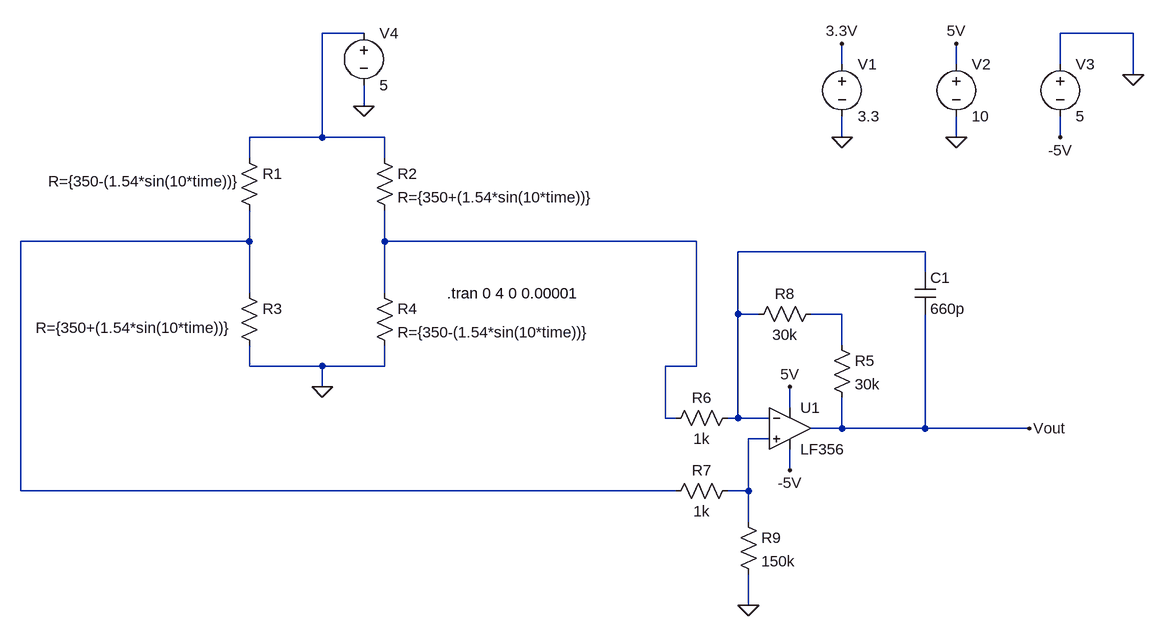
[diagram p0: schematic WheatstoneAndAmplifier - C.asc]
WheatstoneAndAmplifier - C.asc, the LTspice schematic file:
Version 4
SHEET 1 880 1060
WIRE -656 32 -720 32
WIRE 528 32 416 32
WIRE 80 80 80 48
WIRE 256 80 256 48
WIRE 416 80 416 32
WIRE 528 96 528 32
WIRE -656 144 -656 112
WIRE -720 192 -720 32
WIRE -720 192 -832 192
WIRE -624 192 -720 192
WIRE 80 192 80 160
WIRE 256 192 256 160
WIRE 416 192 416 160
WIRE -832 224 -832 192
WIRE -624 224 -624 192
WIRE -832 352 -832 304
WIRE -832 352 -1184 352
WIRE -624 352 -624 304
WIRE -144 352 -624 352
WIRE 208 368 -80 368
WIRE 208 400 208 368
WIRE -832 432 -832 352
WIRE -624 432 -624 352
WIRE -80 464 -80 368
WIRE -48 464 -80 464
WIRE 80 464 32 464
WIRE 80 512 80 464
WIRE -832 544 -832 512
WIRE -720 544 -832 544
WIRE -624 544 -624 512
WIRE -624 544 -720 544
WIRE -144 544 -144 352
WIRE -144 544 -192 544
WIRE -720 576 -720 544
WIRE 0 608 0 576
WIRE -192 624 -192 544
WIRE -176 624 -192 624
WIRE -80 624 -80 464
WIRE -80 624 -96 624
WIRE -32 624 -80 624
WIRE 80 640 80 592
WIRE 80 640 32 640
WIRE 208 640 208 464
WIRE 208 640 80 640
WIRE 368 640 208 640
WIRE -32 656 -64 656
WIRE 0 704 0 672
WIRE -1184 736 -1184 352
WIRE -176 736 -1184 736
WIRE -64 736 -64 656
WIRE -64 736 -96 736
WIRE -64 784 -64 736
WIRE -64 912 -64 864
FLAG 80 192 0
FLAG 256 192 0
FLAG 80 48 3.3V
FLAG 256 48 5V
FLAG -720 576 0
FLAG 528 96 0
FLAG 416 192 -5V
FLAG 0 576 5V
FLAG 0 704 -5V
FLAG -656 144 0
FLAG 368 640 Vout
FLAG -64 912 0
SYMBOL voltage 80 64 R0
WINDOW 123 0 0 Left 0
WINDOW 39 0 0 Left 0
SYMATTR InstName V1
SYMATTR Value 3.3
SYMBOL voltage 256 64 R0
WINDOW 123 0 0 Left 0
WINDOW 39 0 0 Left 0
SYMATTR InstName V2
SYMATTR Value 10
SYMBOL res -848 208 R0
WINDOW 3 -294 52 Left 2
SYMATTR Value R={350-(1.54*sin(10*time))}
SYMATTR InstName R1
SYMBOL res -640 208 R0
SYMATTR InstName R2
SYMATTR Value R={350+(1.54*sin(10*time))}
SYMBOL res -848 416 R0
WINDOW 3 -313 69 Left 2
SYMATTR Value R={350+(1.54*sin(10*time))}
SYMATTR InstName R3
SYMBOL res -640 416 R0
SYMATTR InstName R4
SYMATTR Value R={350-(1.54*sin(10*time))}
SYMBOL voltage 416 64 R0
WINDOW 123 0 0 Left 0
WINDOW 39 0 0 Left 0
SYMATTR InstName V3
SYMATTR Value 5
SYMBOL Opamps\\LF356 0 576 R0
SYMATTR InstName U1
SYMBOL res -80 608 R90
WINDOW 0 0 56 VBottom 2
WINDOW 3 32 56 VTop 2
SYMATTR InstName R6
SYMATTR Value 1k
SYMATTR SpiceLine tol=5 pwr=.5
SYMBOL res -80 720 R90
WINDOW 0 0 56 VBottom 2
WINDOW 3 32 56 VTop 2
SYMATTR InstName R7
SYMATTR Value 1k
SYMATTR SpiceLine tol=5 pwr=.5
SYMBOL res 48 448 R90
WINDOW 0 0 56 VBottom 2
WINDOW 3 32 56 VTop 2
SYMATTR InstName R8
SYMATTR Value 30k
SYMATTR SpiceLine tol=5 pwr=.5
SYMBOL res -80 768 R0
SYMATTR InstName R9
SYMATTR Value 150k
SYMATTR SpiceLine tol=5 pwr=.5
SYMBOL voltage -656 16 R0
WINDOW 123 0 0 Left 0
WINDOW 39 0 0 Left 0
SYMATTR InstName V4
SYMATTR Value 5
SYMBOL res 64 496 R0
SYMATTR InstName R5
SYMATTR Value 30k
SYMBOL cap 192 400 R0
SYMATTR InstName C1
SYMATTR Value 660p
TEXT -528 432 Left 2 !.tran 0 4 0 0.00001

The netlist it stands for:
* WheatstoneAndAmplifier - C.asc
V1 3.3V 0 3.3
V2 5V 0 10
R1 N001 N002 R={350-(1.54*sin(10*time))}
R2 N001 N003 R={350+(1.54*sin(10*time))}
R3 N002 0 R={350+(1.54*sin(10*time))}
R4 N003 0 R={350-(1.54*sin(10*time))}
V3 0 -5V 5
XU1 N006 N004 5V -5V Vout LF356  ; pins In+ In- V+ V- OUT
R6 N004 N003 1k tol=5 pwr=.5
R7 N006 N002 1k tol=5 pwr=.5
R8 N005 N004 30k tol=5 pwr=.5
R9 N006 0 150k tol=5 pwr=.5
V4 N001 0 5
R5 N005 Vout 30k
C1 N004 Vout 660p
.tran 0 4 0 0.00001
.lib LF356.sub
.backanno
.end